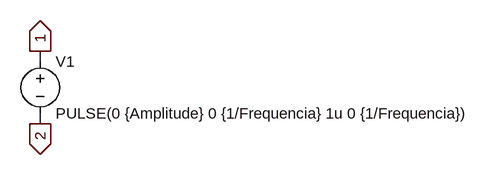
[diagram p0: schematic _RampSource.asc]
_RampSource.asc, the LTspice schematic file:
Version 4
SHEET 1 880 680
WIRE 80 112 80 96
WIRE 80 208 80 192
FLAG 80 96 1
IOPIN 80 96 Out
FLAG 80 208 2
IOPIN 80 208 Out
SYMBOL voltage 80 96 R0
WINDOW 3 24 96 Left 0
WINDOW 123 0 0 Left 0
WINDOW 39 0 0 Left 0
SYMATTR Value PULSE(0 {Amplitude} 0 {1/Frequencia} 1u 0 {1/Frequencia})
SYMATTR InstName V1

The netlist it stands for:
* _RampSource.asc
V1 1 2 PULSE(0 {Amplitude} 0 {1/Frequencia} 1u 0 {1/Frequencia})
.backanno
.end